# Altium schematic sheet F1C100s.SchDoc
size A4; SheetNumber: 7; SheetTotal: 9
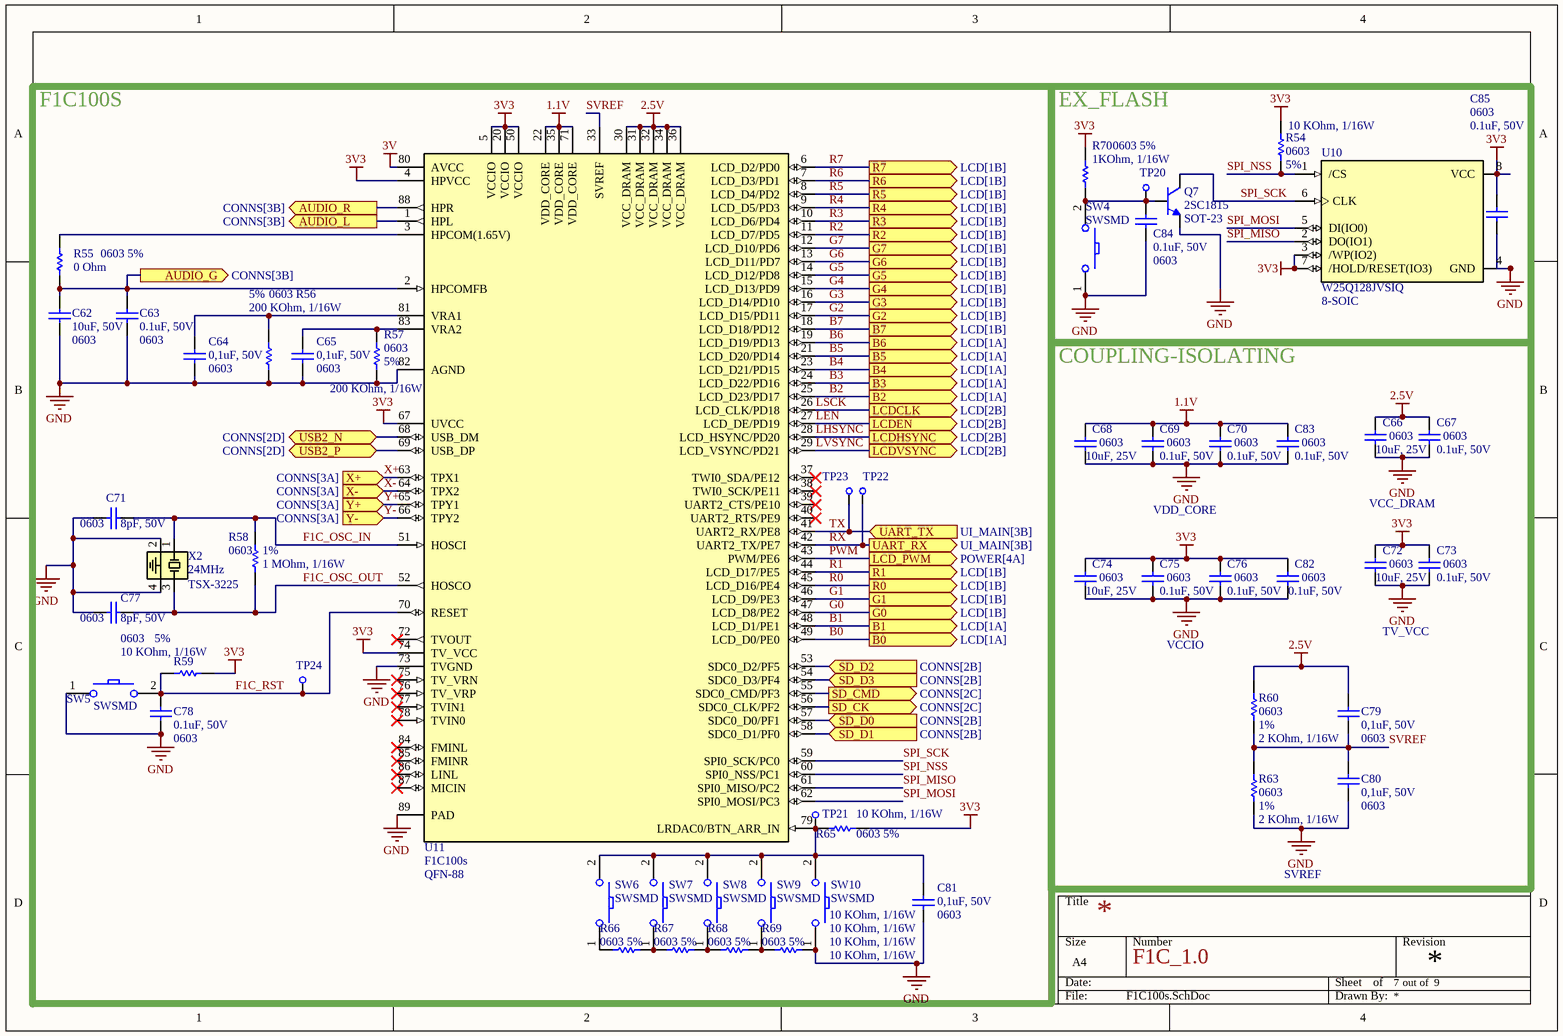
[diagram p0: F1C100s.SchDoc]

## Parts
C62  Package: 0603  [C_0603]  (hidden comment: 10uF, 50V)
C63  Package: 0603  [C_0603]  (hidden comment: 0.1uF, 50V)
C64  Package: 0603  [C_0603]  (hidden comment: 0,1uF, 50V)
C65  Package: 0603  [C_0603]  (hidden comment: 0,1uF, 50V)
C66  Package: 0603  [C_0603]  (hidden comment: 10uF, 25V)
C67  Package: 0603  [C_0603]  (hidden comment: 0.1uF, 50V)
C68  Package: 0603  [C_0603]  (hidden comment: 10uF, 25V)
C69  Package: 0603  [C_0603]  (hidden comment: 0.1uF, 50V)
C70  Package: 0603  [C_0603]  (hidden comment: 0.1uF, 50V)
C71  Package: 0603  [C_0603]  (hidden comment: 8pF, 50V)
C72  Package: 0603  [C_0603]  (hidden comment: 10uF, 25V)
C73  Package: 0603  [C_0603]  (hidden comment: 0.1uF, 50V)
C74  Package: 0603  [C_0603]  (hidden comment: 10uF, 25V)
C75  Package: 0603  [C_0603]  (hidden comment: 0.1uF, 50V)
C76  Package: 0603  [C_0603]  (hidden comment: 0.1uF, 50V)
C77  Package: 0603  [C_0603]  (hidden comment: 8pF, 50V)
C78  Package: 0603  [C_0603]  (hidden comment: 0.1uF, 50V)
C79  Package: 0603  [C_0603]  (hidden comment: 0,1uF, 50V)
C80  Package: 0603  [C_0603]  (hidden comment: 0,1uF, 50V)
C81  Package: 0603  [C_0603]  (hidden comment: 0,1uF, 50V)
C82  Package: 0603  [C_0603]  (hidden comment: 0.1uF, 50V)
C83  Package: 0603  [C_0603]  (hidden comment: 0.1uF, 50V)
C84  Package: 0603  [C_0603]  (hidden comment: 0.1uF, 50V)
C85  Package: 0603  [C_0603]  (hidden comment: 0.1uF, 50V)
Q7  2SC1815  Package: SOT-23  [PKG_SOT-23]
R54  Package: 0603  Acc: 5%  [R_0603]  (hidden comment: 10 KOhm, 1/16W)
R55  Package: 0603  Acc: 5%  [R_0603]  (hidden comment: 0 Ohm)
R56  Package: 0603  Acc: 5%  [R_0603]  (hidden comment: 200 KOhm, 1/16W)
R57  Package: 0603  Acc: 5%  [R_0603]  (hidden comment: 200 KOhm, 1/16W)
R58  Package: 0603  Acc: 1%  [R_0603]  (hidden comment: 1 MOhm, 1/16W)
R59  Package: 0603  Acc: 5%  [R_0603]  (hidden comment: 10 KOhm, 1/16W)
R60  Package: 0603  Acc: 1%  [R_0603]  (hidden comment: 2 KOhm, 1/16W)
R63  Package: 0603  Acc: 1%  [R_0603]  (hidden comment: 2 KOhm, 1/16W)
R65  Package: 0603  Acc: 5%  [R_0603]  (hidden comment: 10 KOhm, 1/16W)
R66  Package: 0603  Acc: 5%  [R_0603]  (hidden comment: 10 KOhm, 1/16W)
R67  Package: 0603  Acc: 5%  [R_0603]  (hidden comment: 10 KOhm, 1/16W)
R68  Package: 0603  Acc: 5%  [R_0603]  (hidden comment: 10 KOhm, 1/16W)
R69  Package: 0603  Acc: 5%  [R_0603]  (hidden comment: 10 KOhm, 1/16W)
R70  Package: 0603  Acc: 5%  [R_0603]  (hidden comment: 1KOhm, 1/16W)
SW4  SWSMD  [SW_SMD_NOGND]
SW5  SWSMD  [SW_SMD_NOGND]
SW6  SWSMD  [SW_SMD_NOGND]
SW7  SWSMD  [SW_SMD_NOGND]
SW8  SWSMD  [SW_SMD_NOGND]
SW9  SWSMD  [SW_SMD_NOGND]
SW10  SWSMD  [SW_SMD_NOGND]
TP20  TESTPT  [TESTPT]  (value not drawn)  (no BOM)
TP21  TESTPT  [TESTPT]  (value not drawn)  (no BOM)
TP22  TESTPT  [TESTPT]  (value not drawn)  (no BOM)
TP23  TESTPT  [TESTPT]  (value not drawn)  (no BOM)
TP24  TESTPT  [TESTPT]  (value not drawn)  (no BOM)
U10  W25Q128JVSIQ  Package: 8-SOIC  [PKG_8-SOIC]
U11  F1C100s  Package: QFN-88  [PKG_QFN-88]
X2  24MHz  Package: TSX-3225  [PKG_TSX-3225]

## Blocks framed on the sheet
F1C100S: C62-C65 C71 C77 C78 C81 R55-R59 R65-R69 SW5-SW10 TP21-TP24 U11 X2
EX_FLASH: C84 C85 Q7 R54 R70 SW4 TP20 U10
COUPLING-ISOLATING: C66-C70 C72-C76 C79 C80 C82 C83 R60 R63

## Ports
AUDIO_G (out, see CONNS[3B]), AUDIO_L (out, see CONNS[3B]), AUDIO_R (out, see CONNS[3B]), B0 (out, see LCD[1A]), B1 (out, see LCD[1A]), B2 (out, see LCD[1A]), B3 (out, see LCD[1A]), B4 (out, see LCD[1A]), B5 (out, see LCD[1A]), B6 (out, see LCD[1A]), B7 (out, see LCD[1B]), G0 (out, see LCD[1B]), G1 (out, see LCD[1B]), G2 (out, see LCD[1B]), G3 (out, see LCD[1B]), G4 (out, see LCD[1B]), G5 (out, see LCD[1B]), G6 (out, see LCD[1B]), G7 (out, see LCD[1B]), LCD_PWM (out, see POWER[4A]), LCDCLK (out, see LCD[2B]), LCDEN (out, see LCD[2B]), LCDHSYNC (out, see LCD[2B]), LCDVSYNC (out, see LCD[2B]), R0 (out, see LCD[1B]), R1 (out, see LCD[1B]), R2 (out, see LCD[1B]), R3 (out, see LCD[1B]), R4 (out, see LCD[1B]), R5 (out, see LCD[1B]), R6 (out, see LCD[1B]), R7 (out, see LCD[1B]), SD_CK (out, see CONNS[2C]), SD_CMD (out, see CONNS[2C]), SD_D0 (in, see CONNS[2B]), SD_D1 (in, see CONNS[2B]), SD_D2 (in, see CONNS[2B]), SD_D3 (in, see CONNS[2B]), UART_RX (out, see UI_MAIN[3B]), UART_TX (in, see UI_MAIN[3B]), USB2_N (bidir, see CONNS[2D]), USB2_P (bidir, see CONNS[2D]), X+ (in, see CONNS[3A]), X- (in, see CONNS[3A]), Y+ (in, see CONNS[3A]), Y- (in, see CONNS[3A])

## Nets
1.1V: C68.2 C69.2 C70.2 C83.2 U11.22(VDD_CORE) U11.35(VDD_CORE) U11.71(VDD_CORE)
2.5V: C66.2 C67.2 C79.2 R60.2 U11.30(VCC_DRAM) U11.31(VCC_DRAM) U11.32(VCC_DRAM) U11.34(VCC_DRAM) U11.36(VCC_DRAM)
3V: U11.80(AVCC)
3V3: C72.2 C73.2 C74.2 C75.2 C76.2 C82.2 C85.2 R54.2 R59.2 R65.2 R70.2 U10.3(/WP(IO2)) U10.7(/HOLD/RESET(IO3)) U10.8(VCC) U11.4(HPVCC) U11.5(VCCIO) U11.20(VCCIO) U11.50(VCCIO) U11.67(UVCC) U11.74(TV_VCC)
GND: C62.1 C63.1 C64.1 C65.1 C66.1 C67.1 C68.1 C69.1 C70.1 C71.1 C72.1 C73.1 C74.1 C75.1 C76.1 C77.1 C78.1 C80.1 C81.1 C82.1 C83.1 C84.1 C85.1 Q7.2(E) R56.1 R57.1 R63.1 R69.2 SW4.1 SW5.1 SW10.1 U10.4(GND) U11.73(TVGND) U11.82(AGND) U11.89(PAD) X2.2 X2.4
AUDIO_G: C62.2 C63.2 R55.1 U11.2(HPCOMFB) ; port AUDIO_G
AUDIO_L: U11.1(HPL) ; port AUDIO_L
AUDIO_R: U11.88(HPR) ; port AUDIO_R
B0: U11.49(LCD_D0/PE0) ; port B0
B1: U11.48(LCD_D1/PE1) ; port B1
B2: U11.25(LCD_D23/PD17) ; port B2
B3: U11.24(LCD_D22/PD16) ; port B3
B4: U11.23(LCD_D21/PD15) ; port B4
B5: U11.21(LCD_D20/PD14) ; port B5
B6: U11.19(LCD_D19/PD13) ; port B6
B7: U11.18(LCD_D18/PD12) ; port B7
F1C_OSC_IN: C71.2 R58.2 U11.51(HOSCI) X2.1
F1C_OSC_OUT: C77.2 R58.1 U11.52(HOSCO) X2.3
F1C_RST: C78.2 R59.1 SW5.2 TP24.1 U11.70(RESET)
G0: U11.47(LCD_D8/PE2) ; port G0
G1: U11.46(LCD_D9/PE3) ; port G1
G2: U11.17(LCD_D15/PD11) ; port G2
G3: U11.16(LCD_D14/PD10) ; port G3
G4: U11.15(LCD_D13/PD9) ; port G4
G5: U11.14(LCD_D12/PD8) ; port G5
G6: U11.13(LCD_D11/PD7) ; port G6
G7: U11.12(LCD_D10/PD6) ; port G7
LEN: U11.27(LCD_DE/PD19) ; port LCDEN
LHSYNC: U11.28(LCD_HSYNC/PD20) ; port LCDHSYNC
LSCK: U11.26(LCD_CLK/PD18) ; port LCDCLK
LVSYNC: U11.29(LCD_VSYNC/PD21) ; port LCDVSYNC
PWM: U11.43(PWM/PE6) ; port LCD_PWM
R0: U11.45(LCD_D16/PE4) ; port R0
R1: U11.44(LCD_D17/PE5) ; port R1
R2: U11.11(LCD_D7/PD5) ; port R2
R3: U11.10(LCD_D6/PD4) ; port R3
R4: U11.9(LCD_D5/PD3) ; port R4
R5: U11.8(LCD_D4/PD2) ; port R5
R6: U11.7(LCD_D3/PD1) ; port R6
R7: U11.6(LCD_D2/PD0) ; port R7
RX: TP22.1 U11.42(UART2_TX/PE7) ; port UART_RX
SD_CK: U11.56(SDC0_CLK/PF2) ; port SD_CK
SD_CMD: U11.55(SDC0_CMD/PF3) ; port SD_CMD
SD_D0: U11.57(SDC0_D0/PF1) ; port SD_D0
SD_D1: U11.58(SDC0_D1/PF0) ; port SD_D1
SD_D2: U11.53(SDC0_D2/PF5) ; port SD_D2
SD_D3: U11.54(SDC0_D3/PF4) ; port SD_D3
SPI_MISO: U10.2(DO(IO1)) U11.61(SPI0_MISO/PC2)
SPI_MOSI: U10.5(DI(IO0)) U11.62(SPI0_MOSI/PC3)
SPI_NSS: R54.1 U10.1(/CS) U11.60(SPI0_NSS/PC1)
SPI_SCK: Q7.3(C) U10.6(CLK) U11.59(SPI0_SCK/PC0)
SVREF: C79.1 C80.2 R60.1 R63.2 U11.33(SVREF)
TX: TP23.1 U11.41(UART2_RX/PE8) ; port UART_TX
USB2_N: U11.68(USB_DM) ; port USB2_N
USB2_P: U11.69(USB_DP) ; port USB2_P
X+: U11.63(TPX1) ; port X+
X-: U11.64(TPX2) ; port X-
Y+: U11.65(TPY1) ; port Y+
Y-: U11.66(TPY2) ; port Y-
NetC64_2: C64.2 R56.2 U11.81(VRA1)
NetC65_2: C65.2 R57.2 U11.83(VRA2)
NetC81_2: C81.2 R65.1 SW6.2 SW7.2 SW8.2 SW9.2 SW10.2 TP21.1 U11.79(LRDAC0/BTN_ARR_IN)
NetC84_2: C84.2 Q7.1(B) R70.1 SW4.2 TP20.1
NetR55_2: R55.2 U11.3(HPCOM(1.65V))
NetR66_1: R66.1 SW6.1
NetR66_2: R66.2 R67.1 SW7.1
NetR67_2: R67.2 R68.1 SW8.1
NetR68_2: R68.2 R69.1 SW9.1

Not connected (* = marked no-connect by the designer): U11 37(TWI0_SDA/PE12)* 38(TWI0_SCK/PE11)* 39(UART2_CTS/PE10)* 40(UART2_RTS/PE9)* 72(TVOUT)* 75(TV_VRN)* 76(TV_VRP)* 77(TVIN1)* 78(TVIN0)* 84(FMINL)* 85(FMINR)* 86(LINL)* 87(MICIN)*

## Notes on the sheet
- VDD_CORE
- VCC_DRAM
- VCCIO
- TV_VCC
- SVREF
- F1C_1.0
- out of

## Library data of the parts
C62-C85 = CAP_0603: Manufacturer 1: Vishay; Manufacturer Part Number 1: CAP0603; Supplier 1: Thegioiic; Datasheet: https://www.mouser.de/datasheet/2/447/PYu_RC_Group_51_RoHS_L_11-1984063.pdf; Supplier Link: N/a
  C62: Value: 10uF, 50V
  C63 C67 C69 C70 C73 C75 C76 C78 C82-C85: Value: 0.1uF, 50V
  C64 C65 C79-C81: Value: 0,1uF, 50V
  C66 C68 C72 C74: Value: 10uF, 25V
  C71 C77: Value: 8pF, 50V
Q7 = 2SC1815: HF Transistor NPN; Manufacturer 1: TOSHIBA; Manufacturer Part Number 1: 2SC1815; Supplier 1: Thegioiic; Datasheet: https://media.digikey.com/pdf/Data%20Sheets/Toshiba%20PDFs/2SC1815.pdf; Supplier Link: https://www.thegioiic.com/2sc1815-hf-transistor-npn-50v-0-15a-3-chan-sot-23
R54-R60 R63 R65-R70 = RES_0603: Manufacturer 1: Vishay; Manufacturer Part Number 1: RES0603; Supplier 1: Thegioiic; Datasheet: https://www.mouser.de/datasheet/2/447/PYu_RC_Group_51_RoHS_L_11-1984063.pdf; Supplier Link: N/a
  R54 R59 R65-R69: Value: 10 KOhm, 1/16W
  R55: Value: 0 Ohm
  R56 R57: Value: 200 KOhm, 1/16W
  R58: Value: 1 MOhm, 1/16W
  R60 R63: Value: 2 KOhm, 1/16W
  R70: Value: 1KOhm, 1/16W
SW4-SW10 = SWSMD_NOGND: SW_SMD; Manufacturer 1: OEM; Manufacturer Part Number 1: N/a; Supplier 1: Thegioiic; Datasheet: N/a; Supplier Link: https://www.thegioiic.com/nut-nhan-3x6mm-cao-3-5mm-4-chan-smd-chinh-ngang
TP20-TP24 = TESTPT: Test point
U10 = W25Q128JVSIQ: FLASH - NOR Memory IC 128Mb (16M x 8) SPI - Quad I/O, QPI, DTR 133 MHz 8-SOIC; Manufacturer 1: Winbond; Manufacturer Part Number 1: W25Q128JVSIQ; Supplier 1: icdayroi; Datasheet: https://www.mouser.com/datasheet/2/949/w25q128jv_revf_03272018_plus-1489608.pdf?srsltid=AfmBOoo6A117SgcugjxLlAhFi3KnV-0yeS-felQazvL9ciV6qbD4kAKu; Supplier Link: https://icdayroi.com/w25q128jvssiq
U11 = F1C100s: An integrated, low-power ARM9 SoC (System-on-Chip) with 32MB of built-in DDR RAM, widely used for embedded Linux projects, media playback, and retro-gaming consoles.; Manufacturer 1: Allwinner Technology; Manufacturer Part Number 1: F1C100s; Supplier 1: Shoppee; Datasheet: https://linux-sunxi.org/images/1/11/Allwinner_F1C200s_Datasheet_V1.0.pdf; Supplier Link: https://shopee.vn/(1-C%C3%A1i)-chip-%C4%91i%E1%BB%81u-khi%E1%BB%83n-ch%C3%ADnh-ki%E1%BA%BFn-tr%C3%BAc-F1C100-F1C100S-F1C200S-QFN88-QFP128-ARM9-C%C3%B2n-h%C3%A0ng-i.1156302552.41058041933
X2 = XTAL: Crystal, 24 MHz, -30 to 85 degC, 3.2 x 2.5 x 0.9 mm SMD; Manufacturer 1: EPSON; Manufacturer Part Number 1: TSX-3225 25.0000MF20P-C0; Supplier 1: Thegioiic; Datasheet: https://www.epsondevice.com/crystal/en/; Supplier Link: https://www.thegioiic.com/thach-anh-24mhz-3225-4-chan-smd